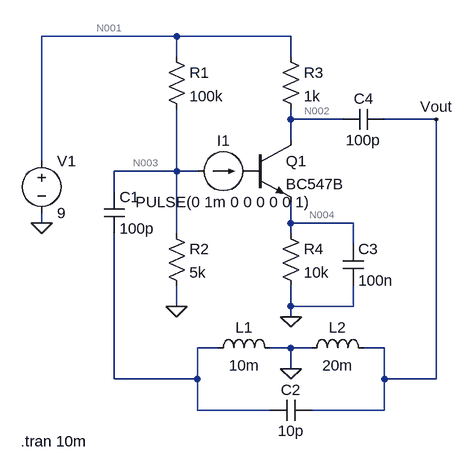
[diagram p0: schematic hartley_osc_2.asc]
hartley_osc_2.asc, the LTspice schematic file:
Version 4
SHEET 1 880 680
WIRE 352 -48 144 -48
WIRE 528 -48 352 -48
WIRE 352 -16 352 -48
WIRE 528 -16 528 -48
WIRE 528 80 528 64
WIRE 608 80 528 80
WIRE 752 80 672 80
WIRE 528 112 528 80
WIRE 144 144 144 -48
WIRE 352 160 352 64
WIRE 352 160 256 160
WIRE 384 160 352 160
WIRE 256 192 256 160
WIRE 144 240 144 224
WIRE 528 240 528 208
WIRE 624 240 528 240
WIRE 352 256 352 160
WIRE 528 256 528 240
WIRE 624 272 624 240
WIRE 352 368 352 336
WIRE 528 368 528 336
WIRE 624 368 624 336
WIRE 624 368 528 368
WIRE 528 384 528 368
WIRE 416 432 384 432
WIRE 528 432 496 432
WIRE 560 432 528 432
WIRE 672 432 640 432
WIRE 528 464 528 432
WIRE 256 480 256 256
WIRE 384 480 384 432
WIRE 384 480 256 480
WIRE 672 480 672 432
WIRE 752 480 752 80
WIRE 752 480 672 480
WIRE 384 528 384 480
WIRE 496 528 384 528
WIRE 672 528 672 480
WIRE 672 528 560 528
FLAG 144 240 0
FLAG 352 368 0
FLAG 528 384 0
FLAG 528 464 0
FLAG 752 80 Vout
SYMBOL voltage 144 128 R0
WINDOW 123 0 0 Left 0
WINDOW 39 0 0 Left 0
SYMATTR InstName V1
SYMATTR Value 9
SYMBOL res 336 -32 R0
SYMATTR InstName R1
SYMATTR Value 100k
SYMBOL res 336 240 R0
SYMATTR InstName R2
SYMATTR Value 5k
SYMBOL cap 240 192 R0
SYMATTR InstName C1
SYMATTR Value 100p
SYMBOL res 512 240 R0
SYMATTR InstName R4
SYMATTR Value 10k
SYMBOL npn 464 112 R0
SYMATTR InstName Q1
SYMATTR Value BC547B
SYMBOL cap 672 64 R90
WINDOW 0 0 32 VBottom 2
WINDOW 3 32 32 VTop 2
SYMATTR InstName C4
SYMATTR Value 100p
SYMBOL ind 400 448 R270
WINDOW 0 32 56 VTop 2
WINDOW 3 5 56 VBottom 2
SYMATTR InstName L1
SYMATTR Value 10m
SYMBOL ind 544 448 R270
WINDOW 0 32 56 VTop 2
WINDOW 3 5 56 VBottom 2
SYMATTR InstName L2
SYMATTR Value 20m
SYMBOL cap 560 512 R90
WINDOW 0 0 32 VBottom 2
WINDOW 3 32 32 VTop 2
SYMATTR InstName C2
SYMATTR Value 10p
SYMBOL current 384 160 R270
WINDOW 0 32 40 VTop 2
WINDOW 3 -32 40 VBottom 2
WINDOW 123 0 0 Left 0
WINDOW 39 0 0 Left 0
SYMATTR InstName I1
SYMATTR Value PULSE(0 1m 0 0 0 0 0 1)
SYMBOL res 512 -32 R0
SYMATTR InstName R3
SYMATTR Value 1k
SYMBOL cap 608 272 R0
SYMATTR InstName C3
SYMATTR Value 100n
TEXT 112 576 Left 2 !.tran 10m

The netlist it stands for:
* hartley_osc_2.asc
V1 N001 0 9
R1 N001 N003 100k
R2 N003 0 5k
C1 N003 N005 100p
R4 N004 0 10k
Q1 N002 P001 N004 0 BC547B
C4 Vout N002 100p
L1 N005 0 10m
L2 0 Vout 20m
C2 Vout N005 10p
I1 N003 P001 PULSE(0 1m 0 0 0 0 0 1)
R3 N001 N002 1k
C3 N004 0 100n
.model NPN NPN
.model PNP PNP
.lib standard.bjt
.tran 10m
.backanno
.end

* Results of the author's LTspice run, read from the files saved beside the schematic
* Operating Point, zero values left out:
*   V(n001) = 9 V
*   V(n003) = 428.6 mV
*   V(n004) = 14.04 µV
*   V(n002) = 9 V
*   V(p001) = 283 mV
*   Ic(Q1) = 1.404 nA
*   Ie(Q1) = -1.404 nA
*   I(R1) = 85.71 µA
*   I(R2) = 85.71 µA
*   I(R4) = 1.404 nA
*   I(R3) = 1.404 nA
*   I(V1) = -85.72 µA
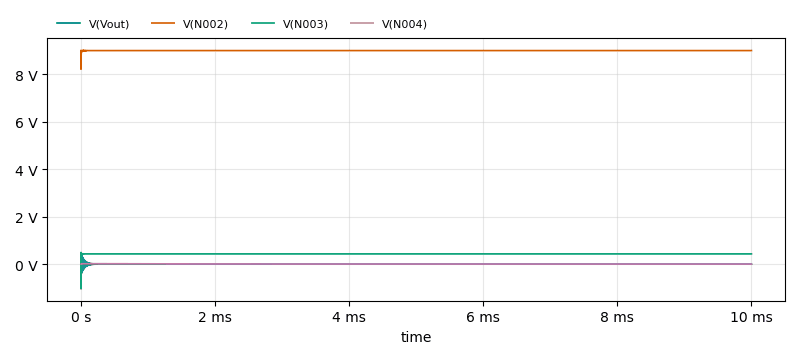
[diagram p1: Transient Analysis of hartley_osc_2.asc, plotted from the saved traces]
* Transient Analysis, 1 run:
*   V(Vout): min -791.2 mV, max 407.2 mV, average -1.002 µV, rms 16.56 mV, last 0 V
*   V(N002): min 8.22 V, max 9.009 V, average 9 V, rms 9 V, last 9 V
*   V(N003): min -1.042 V, max 489.3 mV, average 428.6 mV, rms 428.6 mV, last 428.6 mV
*   V(N004): min 14.04 µV, max 18.24 mV, average 2.745 mV, rms 5.221 mV, last 156.1 µV